# EAGLE design mowgli (EAGLE 7.6.0)
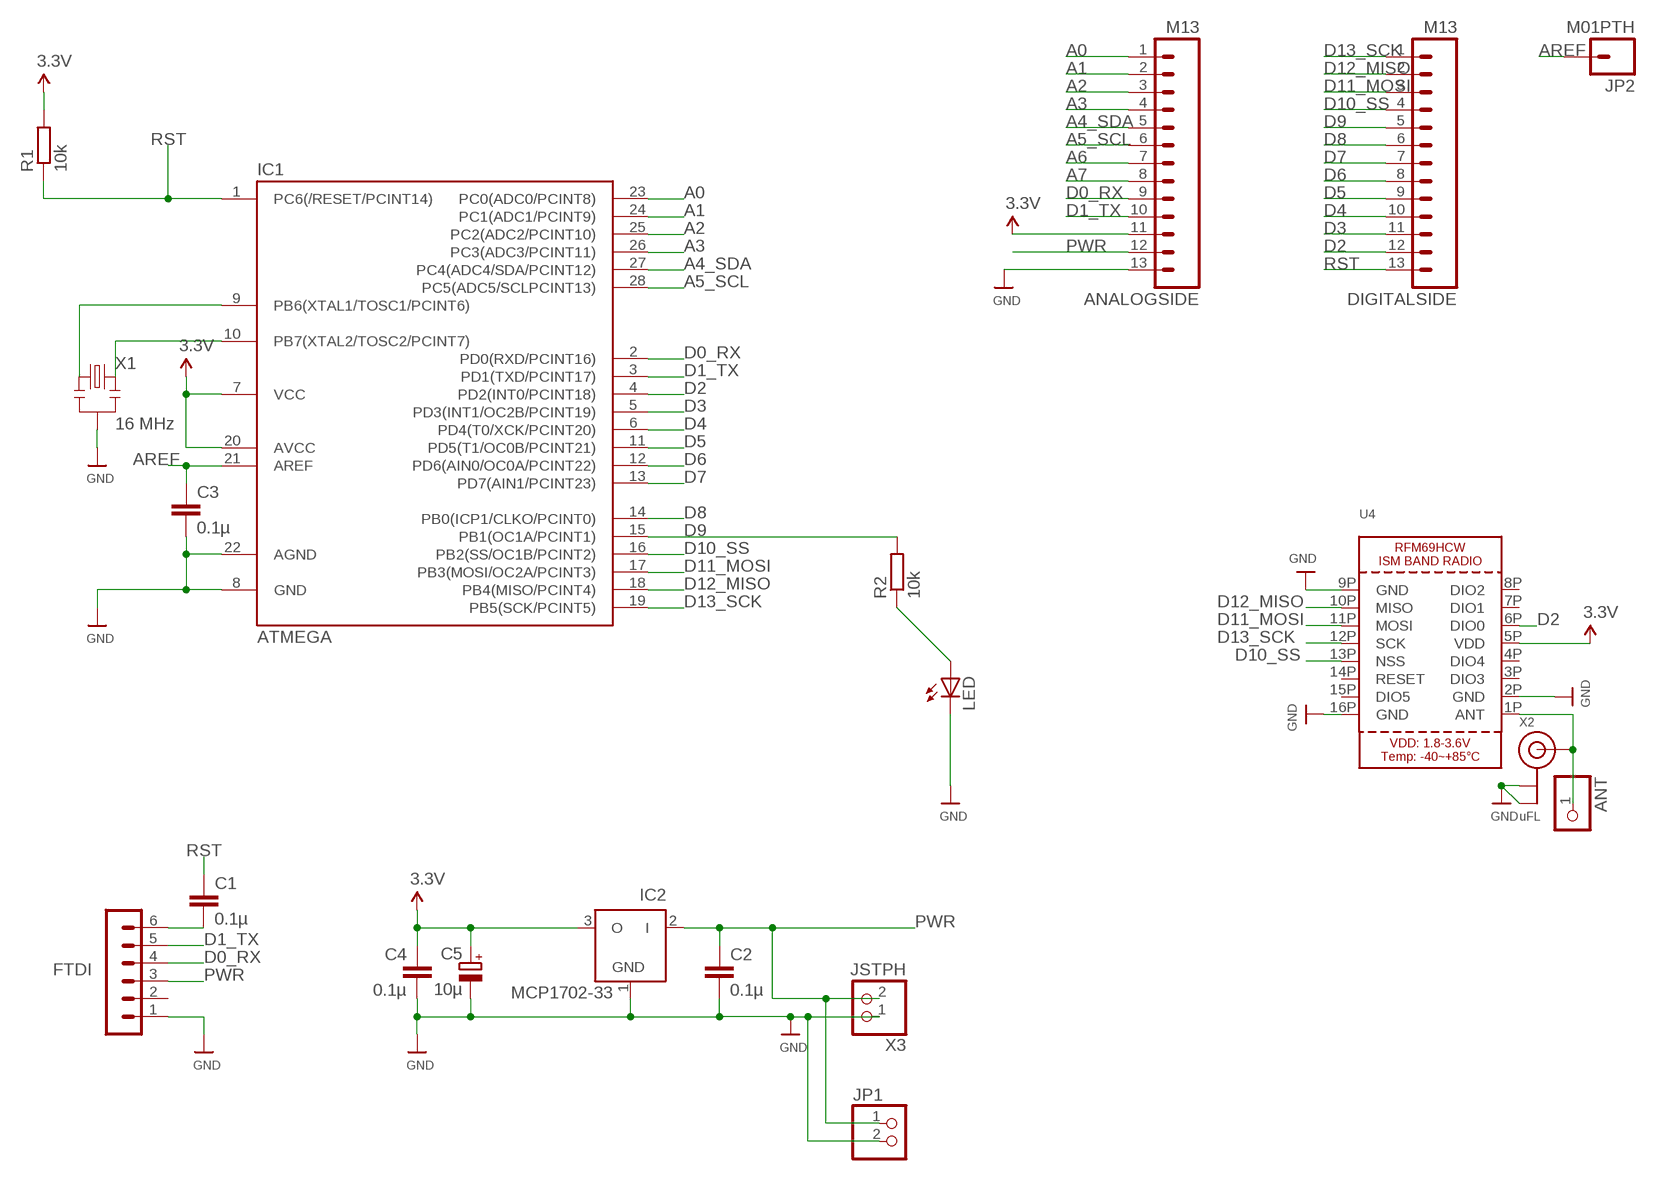
[diagram p0: schematic, sheet 1]

## Parts
ANALOGSIDE  M13  [1X13]
ANT  HEADER-1X1ROUND  [1X01_ROUND]
C1  0.1µ  C-EU025-024X044  [C025-024X044]
C2  0.1µ  C-EU025-024X044  [C025-024X044]
C3  0.1µ  C-EU025-024X044  [C025-024X044]
C4  0.1µ  C-EU025-024X044  [C025-024X044]
C5  10µ  CPOL-EUE1.8-4  [E1,8-4]
DIGITALSIDE  M13  [1X13]
FTDI  FTDI  MA06-1  [MA06-1]
IC1  ATMEGA  ATMEGA48/88/168-PU  [DIL28-3]
IC2  MCP1702-33  MCP1702Z  [TO92]
JP1  PINHD-1X2  [1X02]
JP2  M01PTH  [1X01]
LED  LED3MM  [LED3MM]
R1  10k  R-EU_0204/7  [0204/7]
R2  10k  R-EU_0204/7  [0204/7]
U4  RFM69HCW_SMT  [RFMHCW_SMT]
X1  16 MHz  RESONATORPTH  [RESONATOR-PTH]
X2  uFL  ANTENNA_U.FL  [U.FL]
X3  JSTPH  CON_JST_PH_2PIN  [JSTPH2]

## Nets
A0: ANALOGSIDE.1 IC1.23(PC0(ADC0/PCINT8))
A1: ANALOGSIDE.2 IC1.24(PC1(ADC1/PCINT9))
A2: ANALOGSIDE.3 IC1.25(PC2(ADC2/PCINT10))
A3: ANALOGSIDE.4 IC1.26(PC3(ADC3/PCINT11))
A4_SDA: ANALOGSIDE.5 IC1.27(PC4(ADC4/SDA/PCINT12))
A5_SCL: ANALOGSIDE.6 IC1.28(PC5(ADC5/SCLPCINT13))
A6: ANALOGSIDE.7
A7: ANALOGSIDE.8
ANT: ANT.1 U4.1P(ANT) X2.3(SIGNAL)
AREF: C3.1 IC1.21(AREF) JP2.1
D0_RX: ANALOGSIDE.9 FTDI.4 IC1.2(PD0(RXD/PCINT16))
D1_TX: ANALOGSIDE.10 FTDI.5 IC1.3(PD1(TXD/PCINT17))
D2: DIGITALSIDE.12 IC1.4(PD2(INT0/PCINT18)) U4.6P(DIO0)
D3: DIGITALSIDE.11 IC1.5(PD3(INT1/OC2B/PCINT19))
D4: DIGITALSIDE.10 IC1.6(PD4(T0/XCK/PCINT20))
D5: DIGITALSIDE.9 IC1.11(PD5(T1/OC0B/PCINT21))
D6: DIGITALSIDE.8 IC1.12(PD6(AIN0/OC0A/PCINT22))
D7: DIGITALSIDE.7 IC1.13(PD7(AIN1/PCINT23))
D8: DIGITALSIDE.6 IC1.14(PB0(ICP1/CLKO/PCINT0))
D9: DIGITALSIDE.5 IC1.15(PB1(OC1A/PCINT1)) R2.2
D10_SS: DIGITALSIDE.4 IC1.16(PB2(SS/OC1B/PCINT2)) U4.13P(NSS)
D11_MOSI: DIGITALSIDE.3 IC1.17(PB3(MOSI/OC2A/PCINT3)) U4.11P(MOSI)
D12_MISO: DIGITALSIDE.2 IC1.18(PB4(MISO/PCINT4)) U4.10P(MISO)
D13_SCK: DIGITALSIDE.1 IC1.19(PB5(SCK/PCINT5)) U4.12P(SCK)
GND [power]: ANALOGSIDE.13 C2.2 C3.2 C4.2 C5.- FTDI.1 IC1.8(GND) IC1.22(AGND) IC2.1(GND) JP1.2 LED.K(C) U4.2P(GND) U4.9P(GND) U4.16P(GND) X1.2 X2.1(GND) X2.2(GND) X3.1
N$1: IC1.9(PB6(XTAL1/TOSC1/PCINT6)) X1.1
N$2: LED.A R2.1
N$20: C1.2 FTDI.6
N$21: IC1.10(PB7(XTAL2/TOSC2/PCINT7)) X1.3
PWR [power]: ANALOGSIDE.12 C2.1 FTDI.3 IC2.2(I) JP1.1 X3.2
RST: C1.1 DIGITALSIDE.13 IC1.1(PC6(/RESET/PCINT14)) R1.1
VCC [power]: ANALOGSIDE.11 C4.1 C5.+ IC1.7(VCC) IC1.20(AVCC) IC2.3(O) R1.2 U4.5P(VDD) ; supply symbol labelled 3.3V
Unconnected: FTDI.2 U4.3P(DIO3) U4.4P(DIO4) U4.7P(DIO1) U4.8P(DIO2) U4.14P(RESET) U4.15P(DIO5)

## Library data of the parts
ANALOGSIDE DIGITALSIDE = SparkFun-Connectors:M13: 13-pin single row .1" header
ANT = microbuilder:HEADER-1X1: PIN HEADER
C1-C4 = resistor:C-EU: CAPACITOR, European symbol
C5 = resistor:CPOL-EU: POLARIZED CAPACITOR, European symbol
FTDI = JeeLabs:MA06-1: PIN HEADER
IC1 = atmega8:ATMEGA48/88/168-PU
IC2 = JeeLabs:MCP1702: 200 mA, Low Power Low Dropout Voltage Regulator
JP1 = pinhead:PINHD-1X2: PIN HEADER
JP2 = SparkFun-Connectors:M01: Header 1 Standard 1-pin 0.1" header. Use with straight break away headers (SKU : PRT-00116), right angle break away headers (PRT-00553), swiss pins (PRT-00743), machine pins (PRT-00117), and female headers (PRT-00115).
LED = led:LED: LED OSRAM: - CHIPLED LG R971, LG N971, LY N971, LG Q971, LY Q971, LO R971, LY R971 LH N974, LH R974 LS Q976, LO Q976, LY Q976 LO Q996 - Hyper CHIPLED LW Q18S LB Q993, LB Q99A, LB R99A - SideLED LS A670, LO A670, LY A670, LG A670, LP A670 LB A673, LV A673, LT A673, LW A673 LH A674 LY A675 LS A676, LA A676, LO A676, LY A676, LW A676 LS A679, LY A679, LG A679 - Hyper Micro SIDELED® LS Y876, LA Y876, LO Y876, LY Y876 LT Y87S - SmartLED LW L88C, LW L88S LB L89C, LB L89S, LG L890 LS L89K, LO L89K, LY L89K LS L896, LA L896, LO L896, LY L896 - TOPLED LS T670, LO T670, LY T670, LG T670, LP T670 LSG T670, LSP T670, LSY T670, LOP T670, LYG T670 LG T671, LOG T671, LSG T671 LB T673, LV T673, LT T673, LW T673 LH T674 LS T676, LA T676, LO T676, LY T676, LB T676, LH T676, LSB T676, LW T676 LB T67C, LV T67C, LT T67C, LS T67K, LO T67K, LY T67K, LW E67C LS E67B, LA E67B, LO E67B, LY E67B, LB E67C, LV E67C, LT E67C LW T67C LS T679, LY T679, LG T679 LS T770, LO T770, LY T770, LG T770, LP T770 LB T773, LV T773, LT T773, LW T773 LH T774 LS E675, LA E675, LY E675, LS T675 LS T776, LA T776, LO T776, LY T776, LB T776 LHGB T686 LT T68C, LB T68C - Hyper Mini TOPLED® LB M676 - Mini TOPLED Santana® LG M470 LS M47K, LO M47K, LY M47K Source: http://www.osram.convergy.de LUXEON: - LUMILED® LXK2-PW12-R00, LXK2-PW12-S00, LXK2-PW14-U00, LXK2-PW14-V00 LXK2-PM12-R00, LXK2-PM12-S00, LXK2-PM14-U00 LXK2-PE12-Q00, LXK2-PE12-R00, LXK2-PE12-S00, LXK2-PE14-T00, LXK2-PE14-U00 LXK2-PB12-K00, LXK2-PB12-L00, LXK2-PB12-M00, LXK2-PB14-N00, LXK2-PB14-P00, LXK2-PB14-Q00 LXK2-PR12-L00, LXK2-PR12-M00, LXK2-PR14-Q00, LXK2-PR14-R00 LXK2-PD12-Q00, LXK2-PD12-R00, LXK2-PD12-S00 LXK2-PH12-R00, LXK2-PH12-S00 LXK2-PL12-P00, LXK2-PL12-Q00, LXK2-PL12-R00 Source: www.luxeon.com KINGBRIGHT: KA-3528ASYC Source: www.kingbright.com
R1 R2 = resistor:R-EU_: RESISTOR, European symbol
U4 = microbuilder:RFM69HCW: RFM69HCW - ISM Band RF Transceiver
X1 = SparkFun:RESONATOR: Resonator Small SMD resonator. This is the itty bitty 10/20MHz resonators with built in caps. CSTCE10M0G55 and CSTCE20M0V53. Footprint has been reviewed closely but hasn't been tested yet.
X2 = microbuilder:ANTENNA_U.FL: U.FL Antenna Connector
X3 = microbuilder:CON_JST_PH_2PIN: JST 2-Pin Right-Angle Connector PH-Series - 4UConnector: 17311 SH-Series - 4UConnector: 07278

## Net classes
1 power: width 0.381 mm, clearance 0.254 mm

## Board
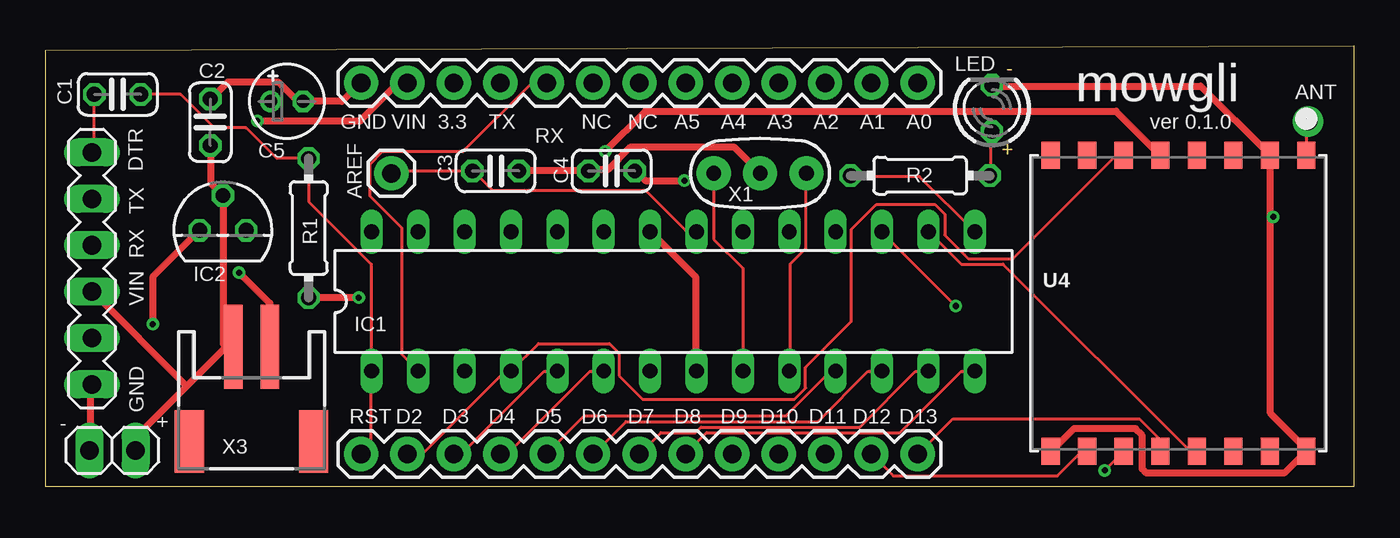
[diagram p1: board, top side]
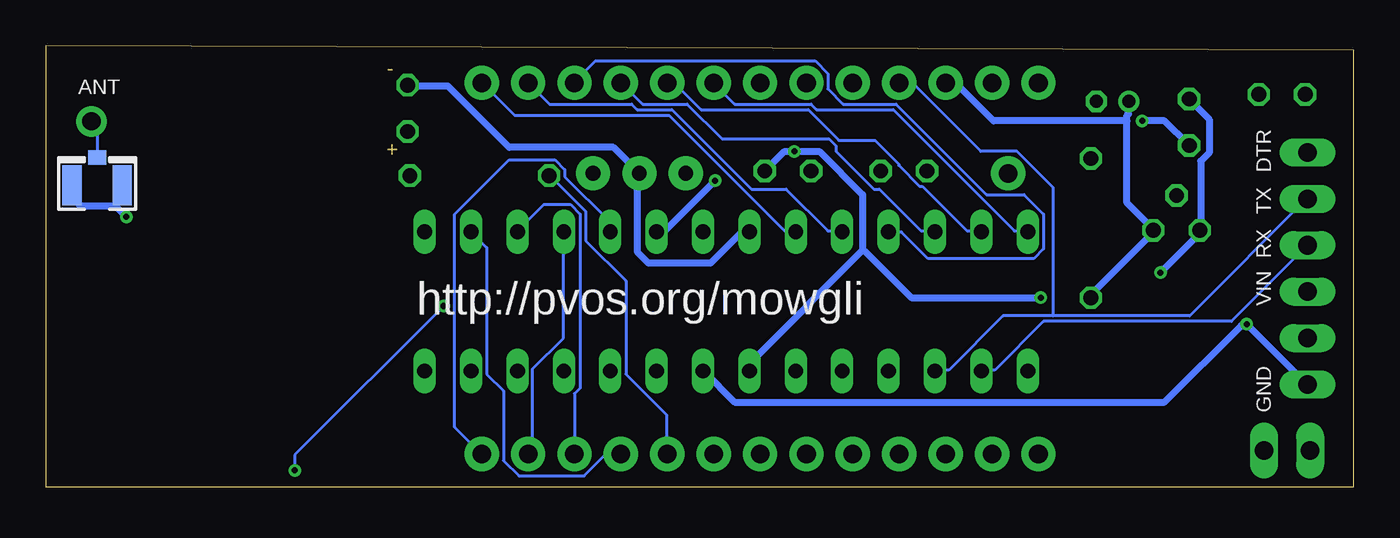
[diagram p2: board, bottom side, seen from below]

Size 71.63 x 24.13 mm. Coordinates in mm from the lower left corner, seen from the top.
Outline: 0,0 0,23.88 71.63,24.13 71.63,0 0,0
Copper layers (1*16): Top 0.0356mm / dielectric 1.5011mm / Bottom 0.0356mm
Design rules "LaenPCBOrder": minimum track width 6mil, minimum drill 13mil, track to track 6mil, track to pad 6mil, pad to pad 6mil, via to via 6mil, smd to smd 6mil, copper to edge 15mil, drill to drill 6mil, minimum pad ring 7mil, minimum via ring 7mil, stop-mask expansion 3mil, vias tented up to drill 0mil, thermal gap 10mil

### Footprints (pad centres in the part's own frame; a part is rotated, then mirrored left to right if it is on the bottom)
1X13 = drill 1.016 pad 1.88: 1 0,0; 2 2.54,0; 3 5.08,0; 4 7.62,0; 5 10.16,0; 6 12.7,0; 7 15.24,0; 8 17.78,0; 9 20.32,0; 10 22.86,0; 11 25.4,0; 12 27.94,0; 13 30.48,0
1X01_ROUND = drill 1 pad 1.676: 1 0,0
C025-024X044 = drill 0.813 octagon: 1 -1.27,0; 2 1.27,0
E1,8-4 = drill 0.711 pad 1.168: + -0.889,0 | drill 0.711 pad 1.168 octagon: - 0.889,0
MA06-1 = drill 1.016 long: 1 0,0; 2 2.54,0; 3 5.08,0; 4 7.62,0; 5 10.16,0; 6 12.7,0
DIL28-3 = drill 0.813 long: 1 -16.51,-3.81; 2 -13.97,-3.81; 3 -11.43,-3.81; 4 -8.89,-3.81; 5 -6.35,-3.81; 6 -3.81,-3.81; 7 -1.27,-3.81; 8 1.27,-3.81; 9 3.81,-3.81; 10 6.35,-3.81; 11 8.89,-3.81; 12 11.43,-3.81; 13 13.97,-3.81; 14 16.51,-3.81; 15 16.51,3.81; 16 13.97,3.81; 17 11.43,3.81; 18 8.89,3.81; 19 6.35,3.81; 20 3.81,3.81; 21 1.27,3.81; 22 -1.27,3.81; 23 -3.81,3.81; 24 -6.35,3.81; 25 -8.89,3.81; 26 -11.43,3.81; 27 -13.97,3.81; 28 -16.51,3.81
TO92 = drill 0.813 octagon: 1 -1.27,0; 2 0,1.905; 3 1.27,0
1X02 = drill 1.016 long: 1 -1.27,0; 2 1.27,0
1X01 = drill 1.016 pad 1.88: 1 0,0
LED3MM = drill 0.813 octagon: A -1.27,0; K 1.27,0
0204/7 = drill 0.813 octagon: 1 -3.81,0; 2 3.81,0
RFMHCW_SMT = smd 1.5 x 1: 1P 8.1,-7; 2P 8.1,-5; 3P 8.1,-3; 4P 8.1,-1; 5P 8.1,1; 6P 8.1,3; 7P 8.1,5; 8P 8.1,7; 9P -8.1,7; 10P -8.1,5; 11P -8.1,3; 12P -8.1,1; 13P -8.1,-1; 14P -8.1,-3; 15P -8.1,-5; 16P -8.1,-7
RESONATOR-PTH = drill 0.8 pad 1.88: 1 -2.54,0; 2 0,0; 3 2.54,0
U.FL = smd 2.2 x 1.05: 1 0,1.375; 2 0,-1.375 | smd 0.8 x 1: 3 1.525,0
JSTPH2 = smd 1 x 4.6: 1 -1,-3.7; 2 1,-3.7 | smd 1.6 x 3.4: NC1 -3.4,1.5; NC2 3.4,1.5

### Placement (x,y rotation side)
ANALOGSIDE  47.75,22.1 180 top
ANT  69.11,19.99 0 top
C1  3.94,21.46 180 top
C2  9.02,19.94 90 top
C3  24.64,17.27 0 top
C4  30.99,17.27 180 top
C5  13.21,21.08 0 top
DIGITALSIDE  47.75,1.78 180 top
FTDI  2.54,5.59 90 top
IC1  34.37,10.13 0 top
IC2  9.7,14.02 0 top
JP1  3.66,1.98 180 top
JP2  18.92,17.14 0 top
LED  51.82,20.7 90 top
R1  14.4,14.15 270 top
R2  47.88,17.02 180 top
U4  62.03,10.03 90 top
X1  39.12,17.14 0 top
X2  68.81,16.48 90 bottom
X3  11.28,3.96 180 top

### Tracks (layer width: path | path; a pad name or v marks a point on that pad's centre or on a via)
A0
  Bottom 0.152: IC1.23 30.56,14 31.17,14 37.49,20.32 45.95,20.32 47.7,22.07 ANALOGSIDE.1
A1
  Bottom 0.152: ANALOGSIDE.2 44.04,20.93 39.55,20.93 39.24,20.62 37.34,20.62 32.99,16.28 31.09,16.28 28.8,14 28.04,14 IC1.24
A2
  Bottom 0.152: IC1.25 25.45,13.92 24.77,13.92 23.32,12.47 17.53,12.47 16.99,13 16.99,14.91 18.06,15.98 20.12,15.98 25.07,20.93 27.96,20.93 28.8,21.77 28.8,22.61 29.49,23.29 41.53,23.29 42.67,22.15 ANALOGSIDE.3
A3
  Bottom 0.152: IC1.26 22.94,14 23.7,14 25.98,16.28 26.29,16.28 28.35,18.34 28.35,18.64 28.73,19.02 34.59,19.02 36.5,20.93 38.94,20.93 40.08,22.07 ANALOGSIDE.4
A4_SDA
  Bottom 0.152: IC1.27 20.42,14 21.18,14 23.62,16.43 23.77,16.43 24.92,17.58 24.92,17.65 26.21,18.95 28.19,18.95 29.87,20.62 35.74,20.62 37.19,22.07 37.57,22.07 ANALOGSIDE.5
A5_SCL
  Bottom 0.152: IC1.28 17.91,14 18.59,14 25.22,20.62 29.41,20.62 29.72,20.93 33.91,20.93 35.05,22.07 ANALOGSIDE.6
ANT
  Top 0.152: U4.1P 69.04,18.19 69.04,19.86 69.11,19.94 ANT.1
  Bottom 0.152: X2.3 68.81,19.63 69.11,19.94 ANT.1
AREF
  Top 0.152: JP2.1 19.05,17.27 C3.1 23.39,17.27 24.46,16.2 32.84,16.2 35.05,14 35.59,14 IC1.21
D0_RX
  Top 0.152: IC1.2 19.51,7.21 19.51,14.15 17.75,15.9 17.75,17.65 18.44,18.34 22.86,18.34 26.59,22.07 27.43,22.07 ANALOGSIDE.9
  Bottom 0.152: FTDI.4 6.71,9.04 16.99,9.04 19.66,6.38 20.34,6.38 IC1.2
D1_TX
  Bottom 0.152: 16.46,9.35 8.99,9.35 2.59,15.75 FTDI.5 | 16.46,9.35 19.2,9.35 22.17,6.38 22.94,6.38 IC1.3 | 16.46,9.35 16.46,16.36 18.44,18.34 20.42,18.34 24.16,22.07 24.84,22.07 ANALOGSIDE.10
D2
  Top 0.152: U4.6P 58.98,18.11 58.6,18.11 52.96,12.47 50.52,12.47 49.23,13.77 49.23,14.91 48.69,15.44 45.49,15.44 44.12,14.07 44.12,9.04 41.61,6.53 41.61,5.38 41,4.78 32.69,4.78 31.39,6.07 31.39,7.29 30.86,7.82 26.98,7.82 IC1.4 25.45,6.3 25.15,6.3 20.65,1.8 19.81,1.8 DIGITALSIDE.12
D3
  Top 0.152: IC1.5 27.96,6.3 27.28,6.3 22.78,1.8 22.4,1.8 DIGITALSIDE.11
D4
  Top 0.152: IC1.6 30.56,6.3 29.79,6.3 25.3,1.8 24.92,1.8 DIGITALSIDE.10
D5
  Top 0.152: IC1.11 43.2,6.3 42.98,6.3 40.54,3.86 29.49,3.86 27.43,1.8 DIGITALSIDE.9
D6
  Top 0.152: IC1.12 45.8,6.3 45.03,6.3 42.29,3.56 31.78,3.56 30.02,1.8 DIGITALSIDE.8
D7
  Top 0.152: DIGITALSIDE.7 33.68,2.95 35.59,2.95 35.89,3.25 44.58,3.25 47.62,6.3 48.31,6.3 IC1.13
D8
  Top 0.152: IC1.14 50.83,6.3 50.14,6.3 46.79,2.95 36.2,2.95 35.05,1.8 DIGITALSIDE.6
D9
  Top 0.152: IC1.15 47.85,16.97 44.12,16.97 R2.2
  Bottom 0.152: DIGITALSIDE.5 37.64,1.8 37.64,3.94 39.85,6.15 39.85,11.25 42.06,13.46 42.06,15.06 44.04,17.04 R2.2
D10_SS
  Top 0.152: U4.13P 63.02,1.96 62.64,1.96 52.43,12.17 50.14,12.17 48.39,13.92 IC1.16
  Bottom 0.152: IC1.16 47.47,13.08 47.47,6.15 46.56,5.23 46.56,1.42 45.72,0.58 42.14,0.58 41,1.73 40.16,1.73 DIGITALSIDE.4
D11_MOSI  (via drill 0.33)
  Top 0.152: v57.99,0.89 58.98,1.88 U4.11P | v49.84,9.88 45.8,13.92 IC1.17
  Bottom 0.152: v57.99,0.89 57.99,1.73 v49.84,9.88 | DIGITALSIDE.3 42.67,5.08 42.37,5.38 42.37,14.91 42.9,15.44 44.35,15.44 45.8,14 IC1.17
D12_MISO
  Top 0.152: DIGITALSIDE.2 46.41,0.58 55.4,0.58 56.69,1.88 57,1.88 U4.10P
  Bottom 0.152: DIGITALSIDE.2 44.96,2.03 44.96,6.45 43.28,8.13 43.28,13.92 IC1.18
D13_SCK
  Top 0.152: DIGITALSIDE.1 49.68,3.71 59.89,3.71 60.96,2.64 60.96,1.96 U4.12P
  Bottom 0.152: DIGITALSIDE.1 49.23,3.25 49.23,14.91 46.25,17.88 43.74,17.88 43.2,17.35 43.2,16.97 40.77,14.53 40.77,14 IC1.19
GND  (via drill 0.33)
  Top 0.381: ANALOGSIDE.13 17.22,22.07 16.23,21.08 C5.- 13.95,21.16 13.72,21.16 12.72,22.15 9.98,22.15 9.07,21.23 C2.2 | JP1.2 2.44,2.03 2.44,5.46 2.51,5.54 FTDI.1 | v5.87,8.89 5.87,11.48 8.38,14 IC2.1 | v10.59,11.71 12.27,10.03 12.27,7.67 X3.1 | U4.9P 55.09,1.96 56.31,3.17 59.66,3.17 60.05,2.79 60.05,0.97 60.27,0.74 67.82,0.74 68.96,1.88 U4.16P 68.96,2.11 67.06,4.01 67.06,14.76 | 67.06,14.76 67.06,18.11 U4.2P 66.9,18.26 63.25,21.92 51.82,21.92 LED.K | v67.21,14.76 67.06,14.76 | IC1.8 35.59,6.38 35.59,11.48 33.15,13.92 IC1.22 | C3.2 C4.2 29.87,17.35 30.79,17.35 32,18.57 37.72,18.57 39.09,17.2 X1.2
  Bottom 0.381: C2.2 8.99,21.16 7.93,20.09 7.93,18.26 8.38,17.8 8.38,14.07 IC2.1 8.46,13.84 v10.59,11.71 | FTDI.1 2.59,5.61 v5.87,8.89 6.02,8.81 6.17,8.81 10.36,4.62 33.91,4.62 35.59,6.3 IC1.8 | 67.86,15.41 67.89,15.37 69.72,15.37 70.18,15.82 70.18,16.43 X2.1 | 67.86,15.41 67.44,15.82 67.44,16.43 X2.2 | v67.21,14.76 67.86,15.41 | LED.K 51.82,21.92 49.61,21.92 46.25,18.57 40.54,18.57 X1.2 39.24,17.04 39.24,12.85 38.63,12.24 35.2,12.24 33.53,13.92 33.15,13.92 IC1.22
N$1
  Top 0.152: IC1.9 38.18,11.94 36.58,13.54 X1.1
N$2
  Top 0.152: R2.1 51.74,17.04 51.74,19.33 51.82,19.41 LED.A
N$20
  Top 0.152: C1.2 2.67,18.41 FTDI.6
N$21
  Top 0.152: IC1.10 40.77,6.38 40.77,12.17 41.61,13 41.61,17.12 X1.3
PWR  (via drill 0.33)
  Top 0.381: C2.1 9.07,18.64 9.07,16.59 9.68,15.98 IC2.2 9.75,15.75 9.75,7.75 9.83,7.59 | 9.83,7.59 7.73,5.5 | 7.73,5.5 4.95,2.72 4.95,2.03 JP1.1 | 9.83,7.59 10.21,7.59 X3.2 | 7.73,5.5 2.59,10.64 FTDI.3 | v11.58,20.02 17.22,20.02 19.28,22.07 19.81,22.07 ANALOGSIDE.12
  Bottom 0.381: v11.58,20.02 10.36,20.02 C2.1
RST
  Top 0.152: DIGITALSIDE.13 17.83,2.34 17.83,6.3 IC1.1 17.83,6.38 17.83,12.17 14.4,15.6 R1.1 12.65,17.96 10.97,19.63 9.22,19.63 7.39,21.46 C1.1
VCC  (via drill 0.33)
  Top 0.381: v30.63,18.34 32.84,20.55 58.6,20.55 60.96,18.19 U4.5P | v34.98,16.74 32.84,16.74 32.31,17.27 C4.1 | v17.14,10.34 R1.2
  Bottom 0.381: 12.42,20.02 12.42,15.52 10.97,14.07 IC2.3 11.05,13.84 14.4,10.49 R1.2 | 12.42,20.02 12.42,20.32 12.34,20.4 12.34,21.08 C5.+ | 12.42,20.02 19.74,20.02 21.79,22.07 22.33,22.07 ANALOGSIDE.11 | C4.1 32.23,17.27 31.17,18.34 v30.63,18.34 29.26,18.34 26.9,15.98 26.9,12.93 | 26.9,12.93 33.07,6.76 33.07,6.38 IC1.7 | v34.98,16.74 37.72,14 38.18,14 IC1.20 | v17.14,10.34 24.23,10.34 26.75,12.85 26.9,12.93

### Text on the board
Dimension: - | +
tPlace: mowgli | ver 0.1.0
bPlace: http://pvos.org/mowgli
tNames: C1 | C2 | LED | GND | VIN | 3.3 | TX | NC | NC | A5 | A4 | A3 | A2 | A1 | A0 | AREF | C3 | RX | C4 | DTR | C5 | TX | R2 | X1 | RX | R1 | VIN | IC2 | IC1 | GND | - | + | RST | D2 | D3 | D4 | D5 | D6 | D7 | D8 | D9 | D10 | D11 | D12 | D13 | X3
bNames: ANT | DTR | TX | RX | VIN | GND